# Altium project LED_Tree.PrjPcb
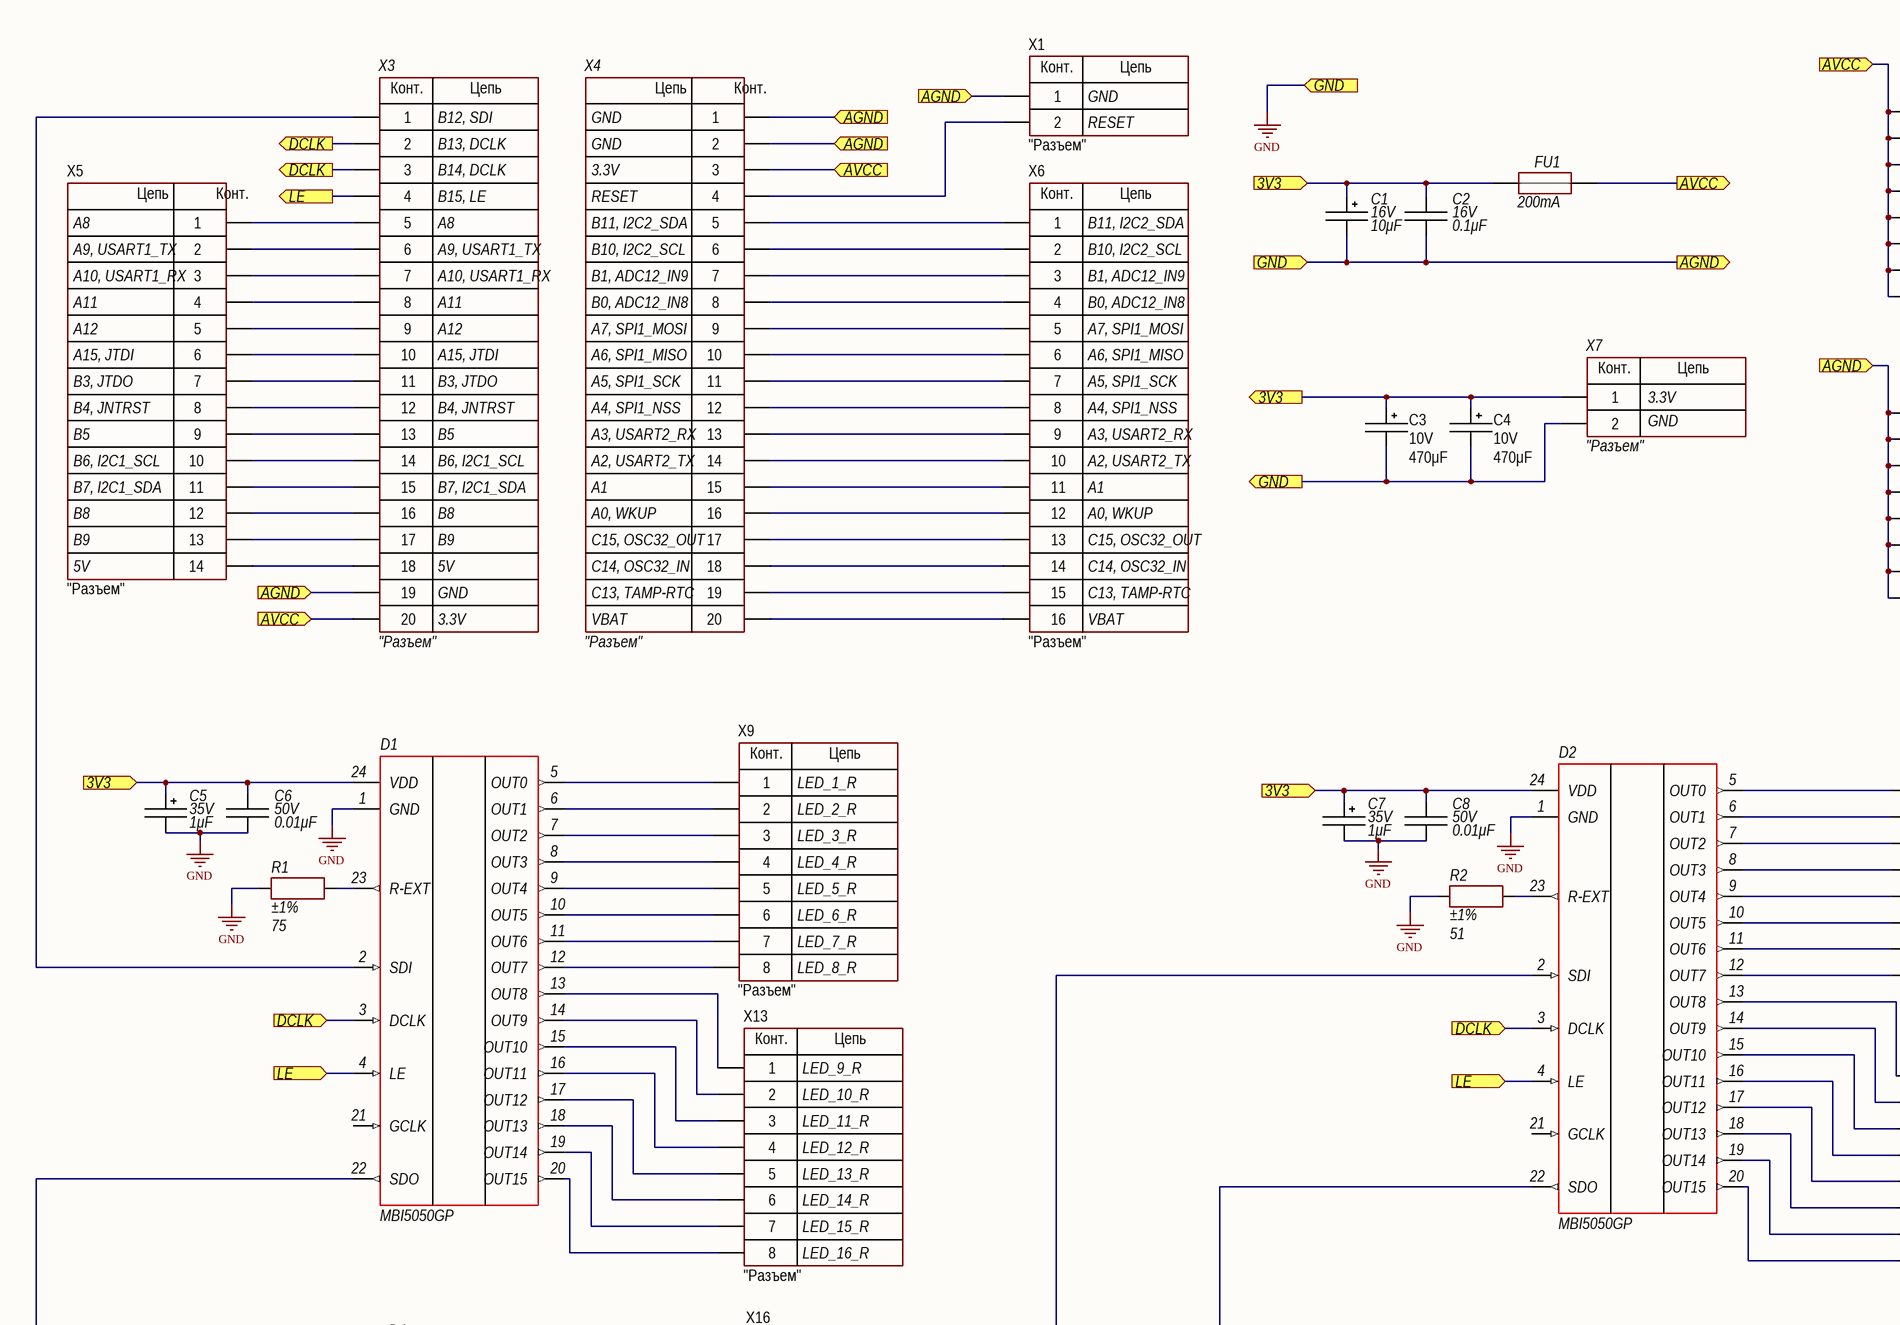
[diagram p0: Led_Tree_Main.SchDoc, top left]
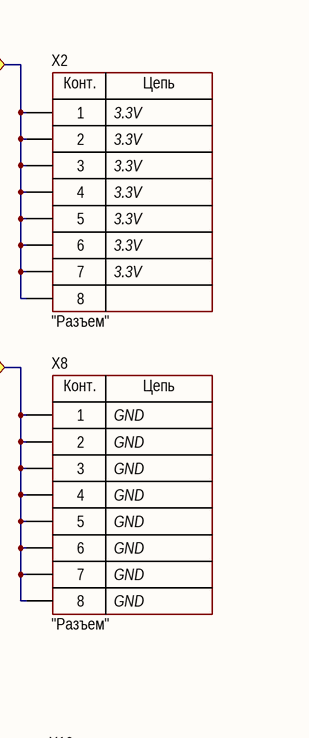
[diagram p1: Led_Tree_Main.SchDoc, top right]
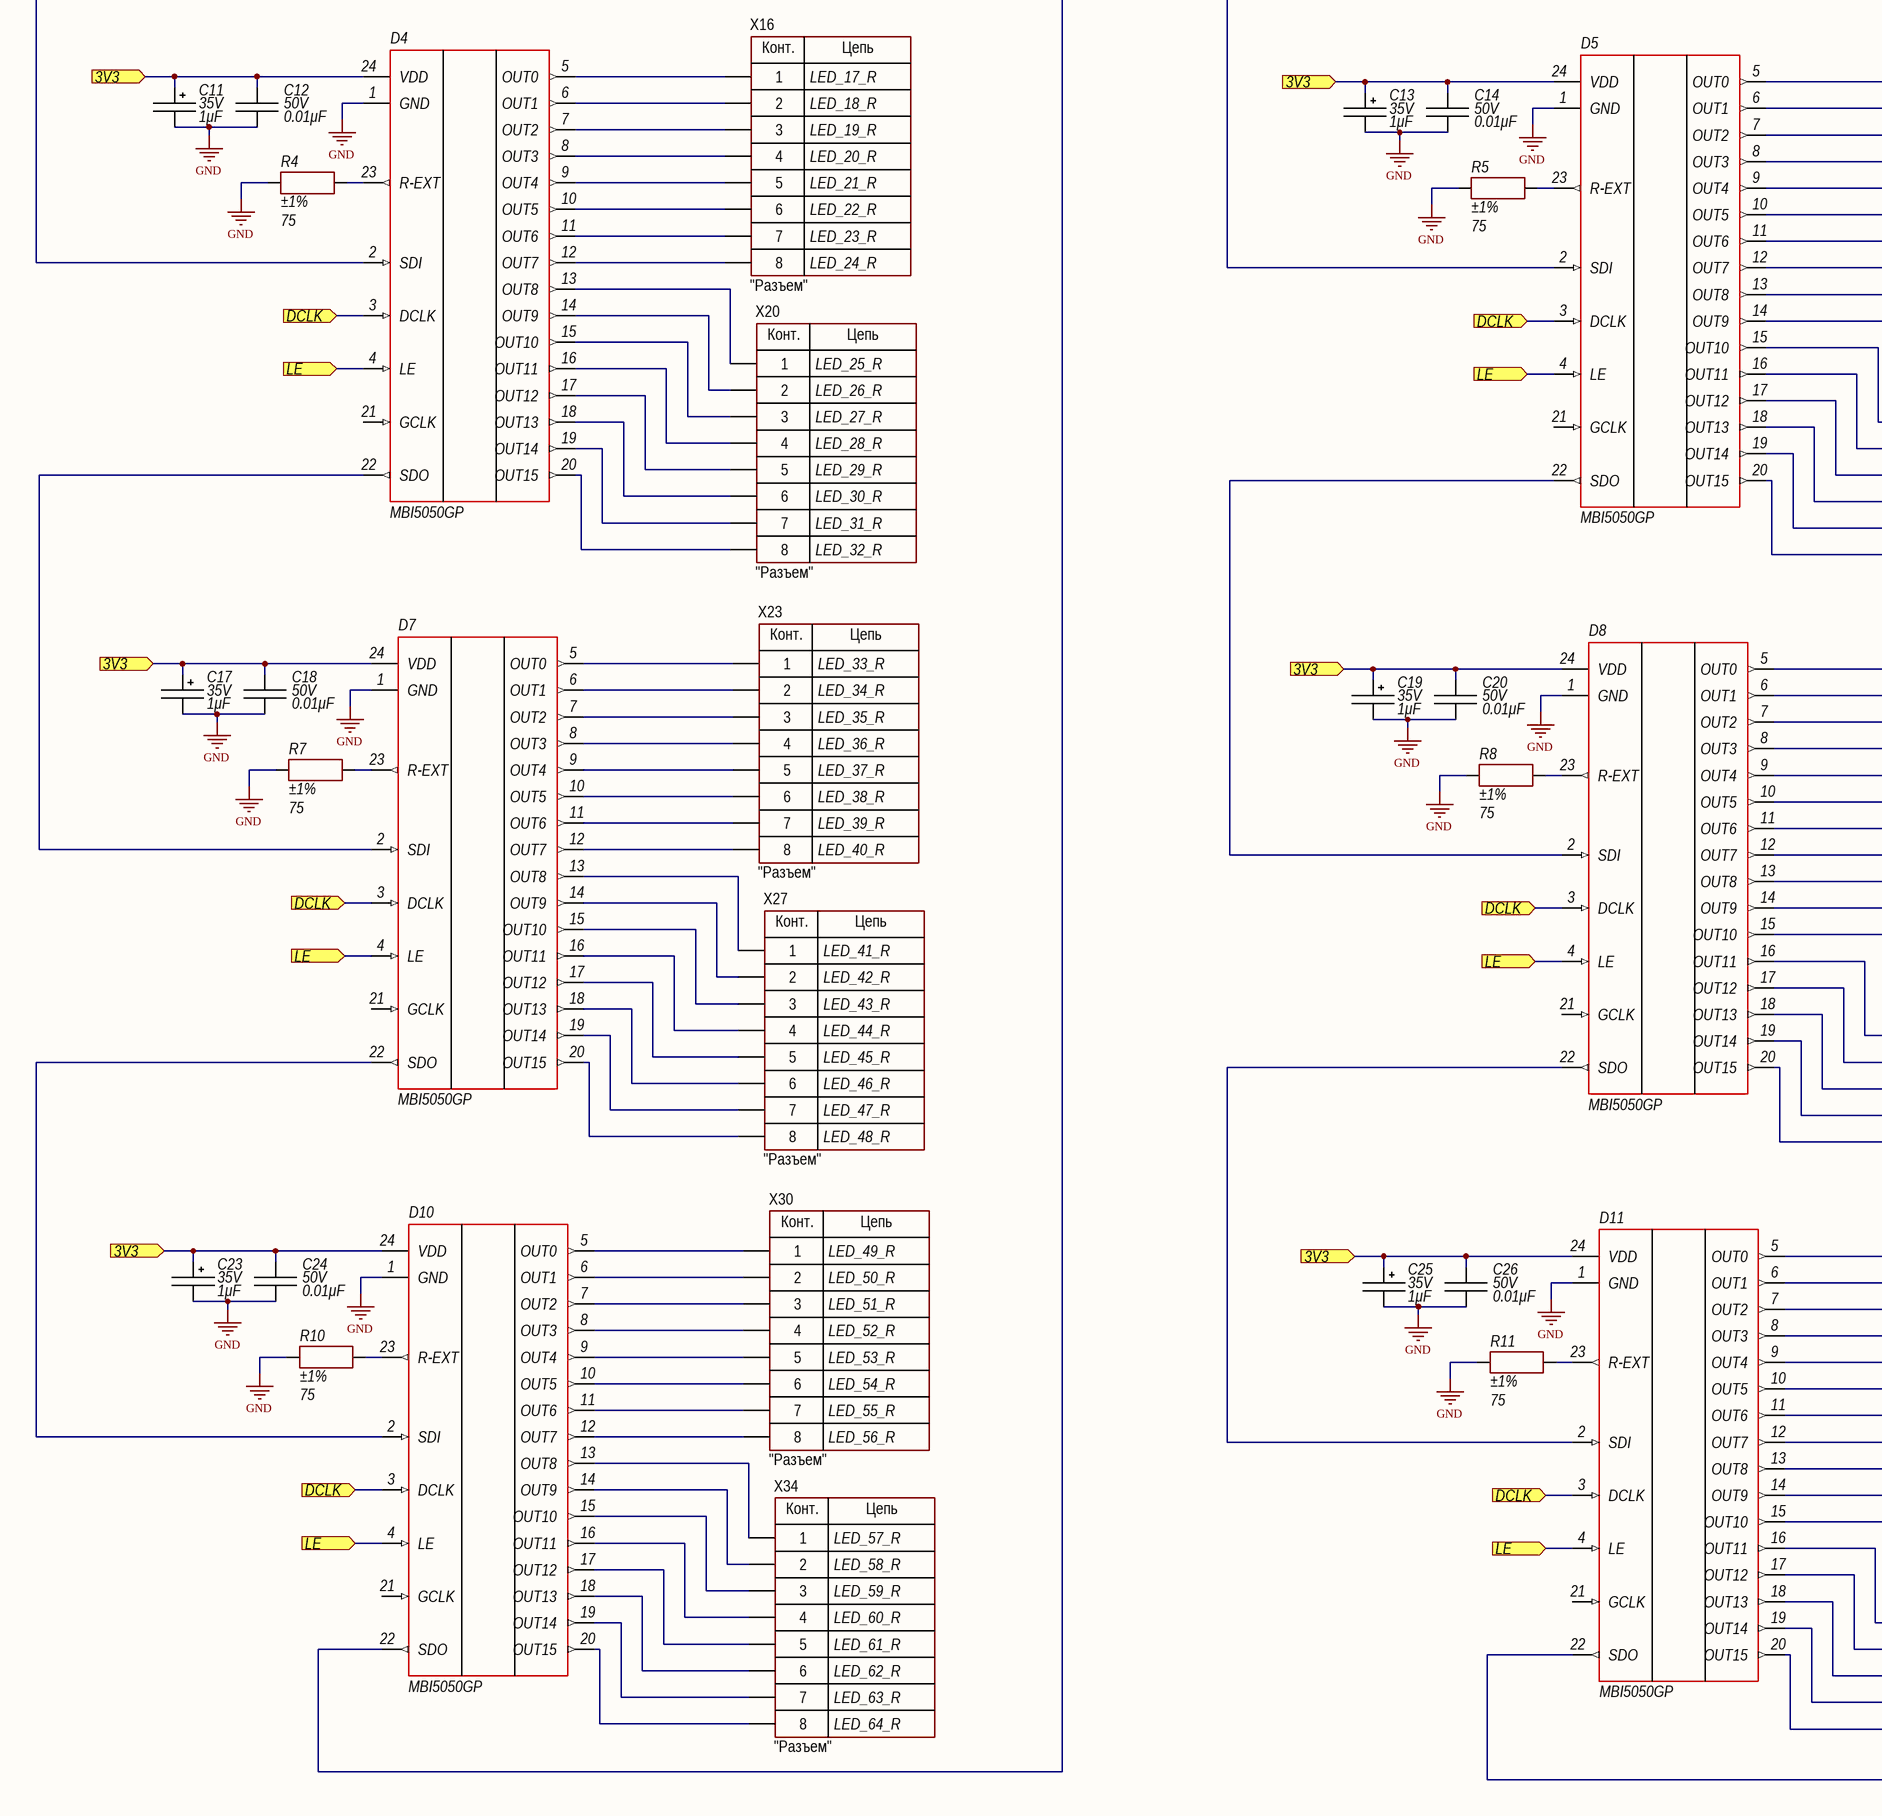
[diagram p2: Led_Tree_Main.SchDoc, bottom left]
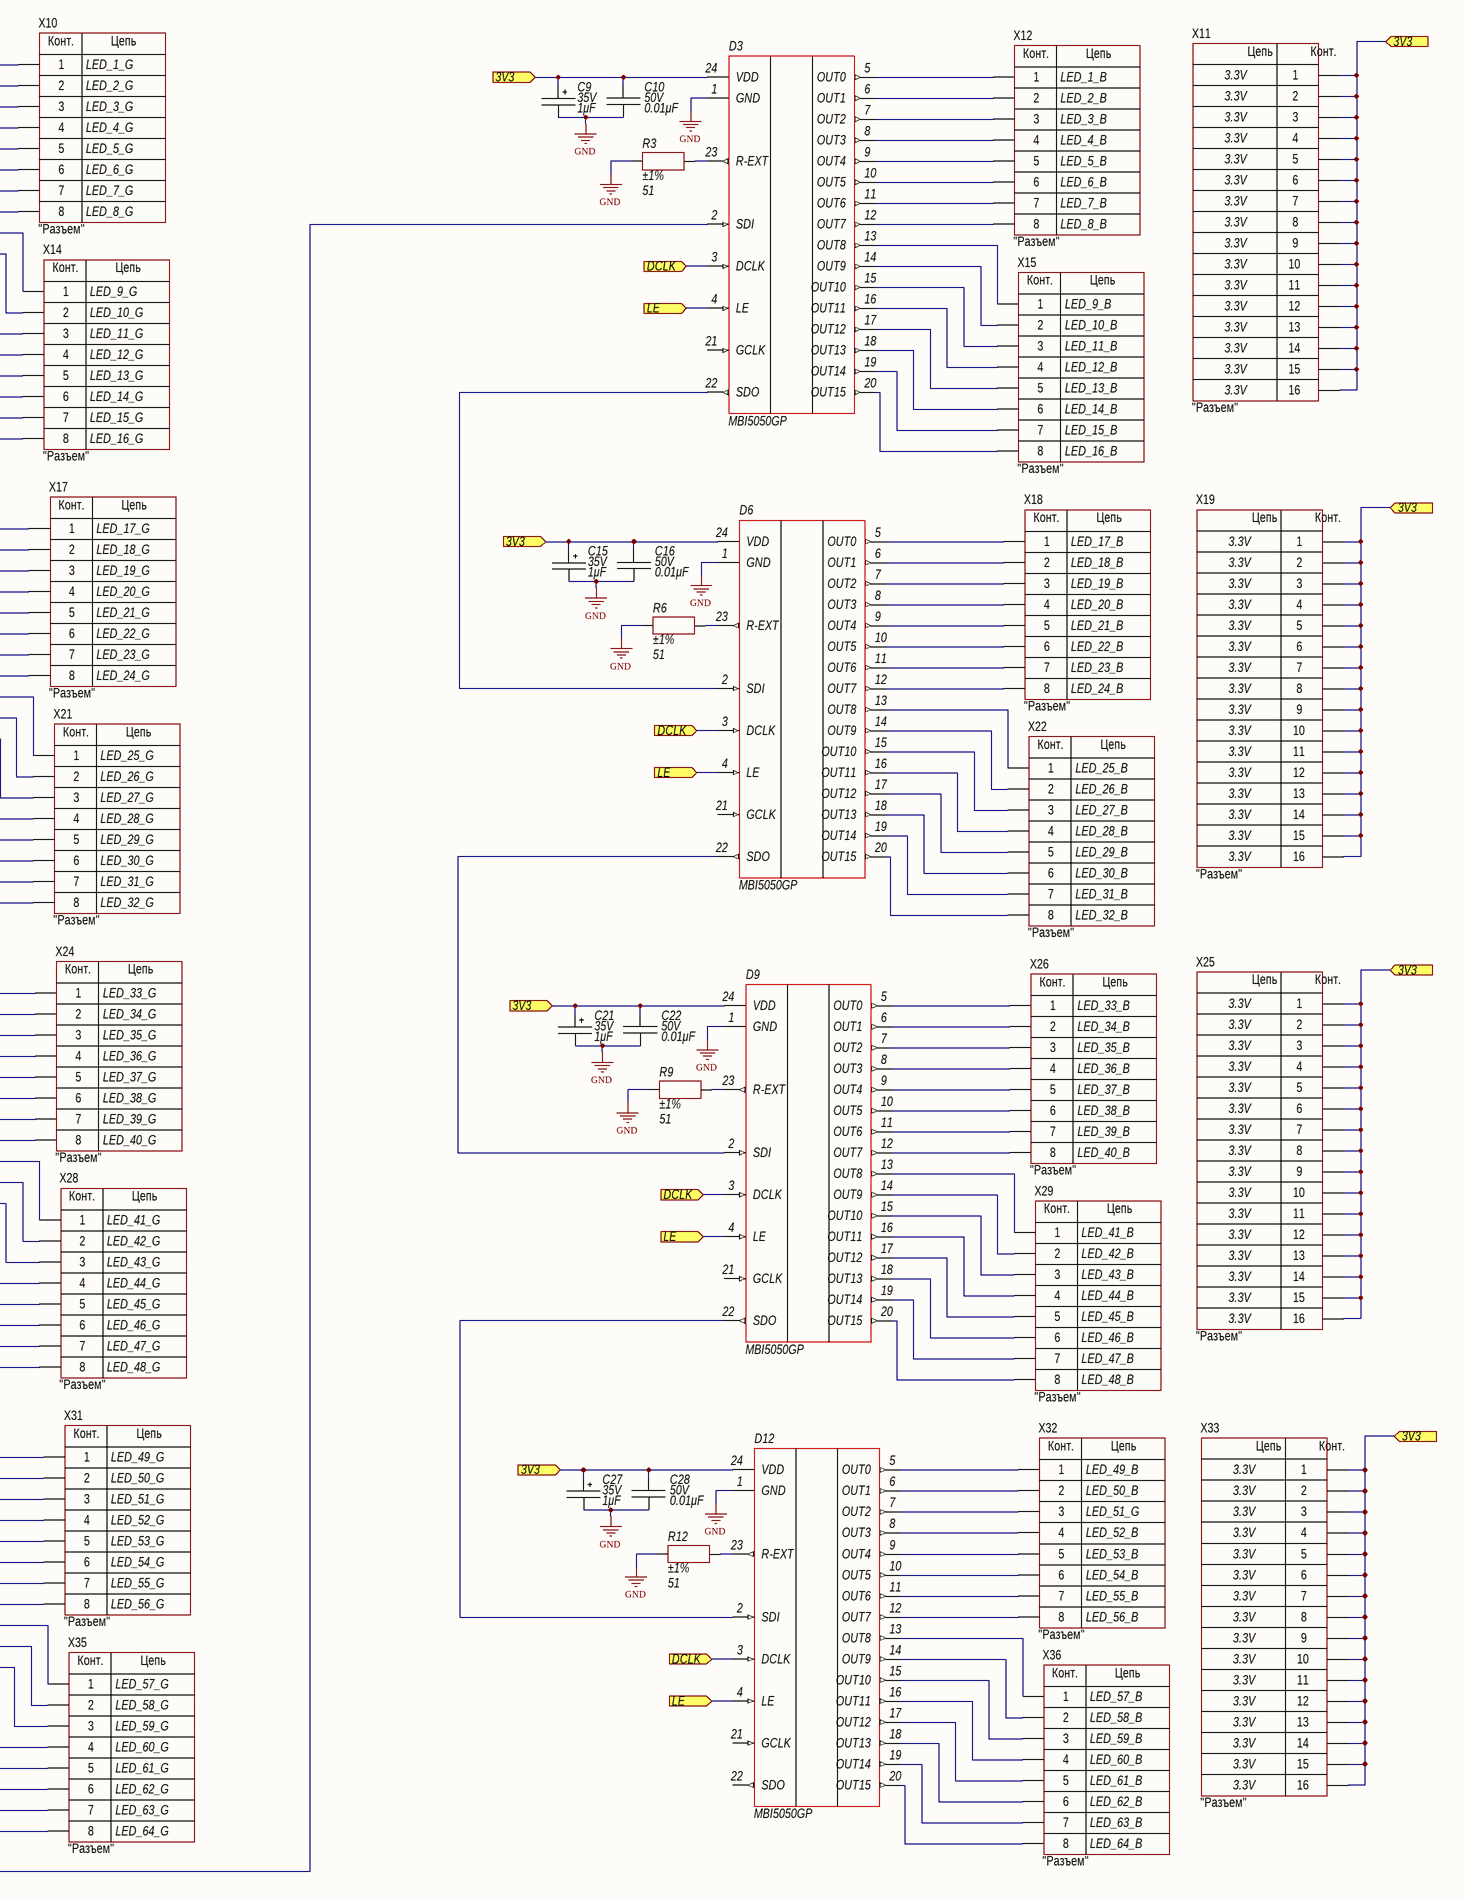
[diagram p3: Led_Tree_Main.SchDoc, bottom right]
1 sheet, 89 parts. Net scope: flat (ports and power ports of the same name join across sheets).
Board file: Led_Tree_Main .PcbDoc

## Sheet Led_Tree_Main.SchDoc
size 1188 x 840 mm; Date: 17.01.2021; Author: Чудаков М.А.; CompanyName: Maxon; DrawnBy: Чудаков М.А.; Address1: Address1; Address2: Address2; Address3: Address3; Address4: Address4; DocumentNumber: 000.000000.001 Э3; SheetNumber: 1; SheetTotal: 1; Scale: 1:1; Title2str: LED TREE; Letter1Column: И; DocumentType: Схема электрическая принципиальная; FirstReferrence: 0000.000000.001; CurrentDate: 17.01.2021; DocumentFullPathAndName: LED TREE; DocumentName: LED TREE; ModifiedDate: 17.01.2021; ProjectName: LED TREE

### Parts
C1  value 10μF  Voltage: 16V  [CAP: TANTAL-A]
C2  value 0.1μF  Voltage: 16V  [CAP: 0603]
C3  value 470μF  Voltage: 10V  [CAP: D6.3C2.5H11]
C4  value 470μF  Voltage: 10V  [CAP: D6.3C2.5H11]
C5  value 1μF  Voltage: 35V  [CAP: TANTAL-A]
C6  value 0.01μF  Voltage: 50V  [CAP: 0603]
C7  value 1μF  Voltage: 35V  [CAP: TANTAL-A]
C8  value 0.01μF  Voltage: 50V  [CAP: 0603]
C9  value 1μF  Voltage: 35V  [CAP: TANTAL-A]
C10  value 0.01μF  Voltage: 50V  [CAP: 0603]
C11  value 1μF  Voltage: 35V  [CAP: TANTAL-A]
C12  value 0.01μF  Voltage: 50V  [CAP: 0603]
C13  value 1μF  Voltage: 35V  [CAP: TANTAL-A]
C14  value 0.01μF  Voltage: 50V  [CAP: 0603]
C15  value 1μF  Voltage: 35V  [CAP: TANTAL-A]
C16  value 0.01μF  Voltage: 50V  [CAP: 0603]
C17  value 1μF  Voltage: 35V  [CAP: TANTAL-A]
C18  value 0.01μF  Voltage: 50V  [CAP: 0603]
C19  value 1μF  Voltage: 35V  [CAP: TANTAL-A]
C20  value 0.01μF  Voltage: 50V  [CAP: 0603]
C21  value 1μF  Voltage: 35V  [CAP: TANTAL-A]
C22  value 0.01μF  Voltage: 50V  [CAP: 0603]
C23  value 1μF  Voltage: 35V  [CAP: TANTAL-A]
C24  value 0.01μF  Voltage: 50V  [CAP: 0603]
C25  value 1μF  Voltage: 35V  [CAP: TANTAL-A]
C26  value 0.01μF  Voltage: 50V  [CAP: 0603]
C27  value 1μF  Voltage: 35V  [CAP: TANTAL-A]
C28  value 0.01μF  Voltage: 50V  [CAP: 0603]
D1  MBI5050GP  [MBI5050GP]
D2  MBI5050GP  [MBI5050GP]
D3  MBI5050GP  [MBI5050GP]
D4  MBI5050GP  [MBI5050GP]
D5  MBI5050GP  [MBI5050GP]
D6  MBI5050GP  [MBI5050GP]
D7  MBI5050GP  [MBI5050GP]
D8  MBI5050GP  [MBI5050GP]
D9  MBI5050GP  [MBI5050GP]
D10  MBI5050GP  [MBI5050GP]
D11  MBI5050GP  [MBI5050GP]
D12  MBI5050GP  [MBI5050GP]
FU1  200mA  [1210L020WR]
R1  value 75  Tolerance: ±1%  [RES: 0603]
R2  value 51  Tolerance: ±1%  [RES: 0603]
R3  value 51  Tolerance: ±1%  [RES: 0603]
R4  value 75  Tolerance: ±1%  [RES: 0603]
R5  value 75  Tolerance: ±1%  [RES: 0603]
R6  value 51  Tolerance: ±1%  [RES: 0603]
R7  value 75  Tolerance: ±1%  [RES: 0603]
R8  value 75  Tolerance: ±1%  [RES: 0603]
R9  value 51  Tolerance: ±1%  [RES: 0603]
R10  value 75  Tolerance: ±1%  [RES: 0603]
R11  value 75  Tolerance: ±1%  [RES: 0603]
R12  value 51  Tolerance: ±1%  [RES: 0603]
X1  CommentText: "Разъем"  [CON: PLS-2]
X2  CommentText: "Разъем"  [CON: PLS-8]
X3  CommentText: "Разъем"  [CON: PBS-20]
X4  CommentText: "Разъем"  [CON: PBS-20]
X5  CommentText: "Разъем"  [CON: PLS-14]
X6  CommentText: "Разъем"  [CON: PLS-16]
X7  CommentText: "Разъем"  [CON: TE 1-770166-0]
X8  CommentText: "Разъем"  [CON: PLS-8]
X9  CommentText: "Разъем"  [CON: PBS-8]
X10  CommentText: "Разъем"  [CON: PBS-8]
X11  CommentText: "Разъем"  [CON: PBS-16]
X12  CommentText: "Разъем"  [CON: PBS-8]
X13  CommentText: "Разъем"  [CON: PBS-8]
X14  CommentText: "Разъем"  [CON: PBS-8]
X15  CommentText: "Разъем"  [CON: PBS-8]
X16  CommentText: "Разъем"  [CON: PBS-8]
X17  CommentText: "Разъем"  [CON: PBS-8]
X18  CommentText: "Разъем"  [CON: PBS-8]
X19  CommentText: "Разъем"  [CON: PBS-16]
X20  CommentText: "Разъем"  [CON: PBS-8]
X21  CommentText: "Разъем"  [CON: PBS-8]
X22  CommentText: "Разъем"  [CON: PBS-8]
X23  CommentText: "Разъем"  [CON: PBS-8]
X24  CommentText: "Разъем"  [CON: PBS-8]
X25  CommentText: "Разъем"  [CON: PBS-16]
X26  CommentText: "Разъем"  [CON: PBS-8]
X27  CommentText: "Разъем"  [CON: PBS-8]
X28  CommentText: "Разъем"  [CON: PBS-8]
X29  CommentText: "Разъем"  [CON: PBS-8]
X30  CommentText: "Разъем"  [CON: PBS-8]
X31  CommentText: "Разъем"  [CON: PBS-8]
X32  CommentText: "Разъем"  [CON: PBS-8]
X33  CommentText: "Разъем"  [CON: PBS-16]
X34  CommentText: "Разъем"  [CON: PBS-8]
X35  CommentText: "Разъем"  [CON: PBS-8]
X36  CommentText: "Разъем"  [CON: PBS-8]

### Ports
3V3 (in), 3V3 (out), AGND (in), AGND (out), AVCC (in), AVCC (out), DCLK (in), DCLK (out), GND (in), GND (out), LE (in), LE (out)

### Nets
GND: C1.2 C2.1 C3.2 C4.2 C5.2 C6.1 C7.2 C8.1 C9.2 C10.1 C11.2 C12.1 C13.2 C14.1 C15.2 C16.1 C17.2 C18.1 C19.2 C20.1 C21.2 C22.1 C23.2 C24.1 C25.2 C26.1 C27.2 C28.1 D1.1(GND) D2.1(GND) D3.1(GND) D4.1(GND) D5.1(GND) D6.1(GND) D7.1(GND) D8.1(GND) D9.1(GND) D10.1(GND) D11.1(GND) D12.1(GND) R1.2 R2.2 R3.2 R4.2 R5.2 R6.2 R7.2 R8.2 R9.2 R10.2 R11.2 R12.2 X1.1 X3.19 X4.1 X4.2 X7.2 X8.1 X8.2 X8.3 X8.4 X8.5 X8.6 X8.7 X8.8 ; port AGND, port GND
NetC1_1: C1.1 C2.2 C3.1 C4.1 C5.1 C6.2 C7.1 C8.2 C9.1 C10.2 C11.1 C12.2 C13.1 C14.2 C15.1 C16.2 C17.1 C18.2 C19.1 C20.2 C21.1 C22.2 C23.1 C24.2 C25.1 C26.2 C27.1 C28.2 D1.24(VDD) D2.24(VDD) D3.24(VDD) D4.24(VDD) D5.24(VDD) D6.24(VDD) D7.24(VDD) D8.24(VDD) D9.24(VDD) D10.24(VDD) D11.24(VDD) D12.24(VDD) FU1.1 X7.1 X11.1 X11.2 X11.3 X11.4 X11.5 X11.6 X11.7 X11.8 X11.9 X11.10 X11.11 X11.12 X11.13 X11.14 X11.15 X11.16 X19.1 X19.2 X19.3 X19.4 X19.5 X19.6 X19.7 X19.8 X19.9 X19.10 X19.11 X19.12 X19.13 X19.14 X19.15 X19.16 X25.1 X25.2 X25.3 X25.4 X25.5 X25.6 X25.7 X25.8 X25.9 X25.10 X25.11 X25.12 X25.13 X25.14 X25.15 X25.16 X33.1 X33.2 X33.3 X33.4 X33.5 X33.6 X33.7 X33.8 X33.9 X33.10 X33.11 X33.12 X33.13 X33.14 X33.15 X33.16 ; port 3V3
NetD1_2: D1.2(SDI) X3.1
NetD1_3: D1.3(DCLK) D2.3(DCLK) D3.3(DCLK) D4.3(DCLK) D5.3(DCLK) D6.3(DCLK) D7.3(DCLK) D8.3(DCLK) D9.3(DCLK) D10.3(DCLK) D11.3(DCLK) D12.3(DCLK) X3.2 X3.3 ; port DCLK
NetD1_4: D1.4(LE) D2.4(LE) D3.4(LE) D4.4(LE) D5.4(LE) D6.4(LE) D7.4(LE) D8.4(LE) D9.4(LE) D10.4(LE) D11.4(LE) D12.4(LE) X3.4 ; port LE
NetD1_5: D1.5(OUT0) X9.1
NetD1_6: D1.6(OUT1) X9.2
NetD1_7: D1.7(OUT2) X9.3
NetD1_8: D1.8(OUT3) X9.4
NetD1_9: D1.9(OUT4) X9.5
NetD1_10: D1.10(OUT5) X9.6
NetD1_11: D1.11(OUT6) X9.7
NetD1_12: D1.12(OUT7) X9.8
NetD1_13: D1.13(OUT8) X13.1
NetD1_14: D1.14(OUT9) X13.2
NetD1_15: D1.15(OUT10) X13.3
NetD1_16: D1.16(OUT11) X13.4
NetD1_17: D1.17(OUT12) X13.5
NetD1_18: D1.18(OUT13) X13.6
NetD1_19: D1.19(OUT14) X13.7
NetD1_20: D1.20(OUT15) X13.8
NetD1_22: D1.22(SDO) D4.2(SDI)
NetD1_23: D1.23(R-EXT) R1.1
NetD2_2: D2.2(SDI) D10.22(SDO)
NetD2_5: D2.5(OUT0) X10.1
NetD2_6: D2.6(OUT1) X10.2
NetD2_7: D2.7(OUT2) X10.3
NetD2_8: D2.8(OUT3) X10.4
NetD2_9: D2.9(OUT4) X10.5
NetD2_10: D2.10(OUT5) X10.6
NetD2_11: D2.11(OUT6) X10.7
NetD2_12: D2.12(OUT7) X10.8
NetD2_13: D2.13(OUT8) X14.1
NetD2_14: D2.14(OUT9) X14.2
NetD2_15: D2.15(OUT10) X14.3
NetD2_16: D2.16(OUT11) X14.4
NetD2_17: D2.17(OUT12) X14.5
NetD2_18: D2.18(OUT13) X14.6
NetD2_19: D2.19(OUT14) X14.7
NetD2_20: D2.20(OUT15) X14.8
NetD2_22: D2.22(SDO) D5.2(SDI)
NetD2_23: D2.23(R-EXT) R2.1
NetD3_2: D3.2(SDI) D11.22(SDO)
NetD3_5: D3.5(OUT0) X12.1
NetD3_6: D3.6(OUT1) X12.2
NetD3_7: D3.7(OUT2) X12.3
NetD3_8: D3.8(OUT3) X12.4
NetD3_9: D3.9(OUT4) X12.5
NetD3_10: D3.10(OUT5) X12.6
NetD3_11: D3.11(OUT6) X12.7
NetD3_12: D3.12(OUT7) X12.8
NetD3_13: D3.13(OUT8) X15.1
NetD3_14: D3.14(OUT9) X15.2
NetD3_15: D3.15(OUT10) X15.3
NetD3_16: D3.16(OUT11) X15.4
NetD3_17: D3.17(OUT12) X15.5
NetD3_18: D3.18(OUT13) X15.6
NetD3_19: D3.19(OUT14) X15.7
NetD3_20: D3.20(OUT15) X15.8
NetD3_22: D3.22(SDO) D6.2(SDI)
NetD3_23: D3.23(R-EXT) R3.1
NetD4_5: D4.5(OUT0) X16.1
NetD4_6: D4.6(OUT1) X16.2
NetD4_7: D4.7(OUT2) X16.3
NetD4_8: D4.8(OUT3) X16.4
NetD4_9: D4.9(OUT4) X16.5
NetD4_10: D4.10(OUT5) X16.6
NetD4_11: D4.11(OUT6) X16.7
NetD4_12: D4.12(OUT7) X16.8
NetD4_13: D4.13(OUT8) X20.1
NetD4_14: D4.14(OUT9) X20.2
NetD4_15: D4.15(OUT10) X20.3
NetD4_16: D4.16(OUT11) X20.4
NetD4_17: D4.17(OUT12) X20.5
NetD4_18: D4.18(OUT13) X20.6
NetD4_19: D4.19(OUT14) X20.7
NetD4_20: D4.20(OUT15) X20.8
NetD4_22: D4.22(SDO) D7.2(SDI)
NetD4_23: D4.23(R-EXT) R4.1
NetD5_5: D5.5(OUT0) X17.1
NetD5_6: D5.6(OUT1) X17.2
NetD5_7: D5.7(OUT2) X17.3
NetD5_8: D5.8(OUT3) X17.4
NetD5_9: D5.9(OUT4) X17.5
NetD5_10: D5.10(OUT5) X17.6
NetD5_11: D5.11(OUT6) X17.7
NetD5_12: D5.12(OUT7) X17.8
NetD5_13: D5.13(OUT8) X21.1
NetD5_14: D5.14(OUT9) X21.2
NetD5_15: D5.15(OUT10) X21.3
NetD5_16: D5.16(OUT11) X21.4
NetD5_17: D5.17(OUT12) X21.5
NetD5_18: D5.18(OUT13) X21.6
NetD5_19: D5.19(OUT14) X21.7
NetD5_20: D5.20(OUT15) X21.8
NetD5_22: D5.22(SDO) D8.2(SDI)
NetD5_23: D5.23(R-EXT) R5.1
NetD6_5: D6.5(OUT0) X18.1
NetD6_6: D6.6(OUT1) X18.2
NetD6_7: D6.7(OUT2) X18.3
NetD6_8: D6.8(OUT3) X18.4
NetD6_9: D6.9(OUT4) X18.5
NetD6_10: D6.10(OUT5) X18.6
NetD6_11: D6.11(OUT6) X18.7
NetD6_12: D6.12(OUT7) X18.8
NetD6_13: D6.13(OUT8) X22.1
NetD6_14: D6.14(OUT9) X22.2
NetD6_15: D6.15(OUT10) X22.3
NetD6_16: D6.16(OUT11) X22.4
NetD6_17: D6.17(OUT12) X22.5
NetD6_18: D6.18(OUT13) X22.6
NetD6_19: D6.19(OUT14) X22.7
NetD6_20: D6.20(OUT15) X22.8
NetD6_22: D6.22(SDO) D9.2(SDI)
NetD6_23: D6.23(R-EXT) R6.1
NetD7_5: D7.5(OUT0) X23.1
NetD7_6: D7.6(OUT1) X23.2
NetD7_7: D7.7(OUT2) X23.3
NetD7_8: D7.8(OUT3) X23.4
NetD7_9: D7.9(OUT4) X23.5
NetD7_10: D7.10(OUT5) X23.6
NetD7_11: D7.11(OUT6) X23.7
NetD7_12: D7.12(OUT7) X23.8
NetD7_13: D7.13(OUT8) X27.1
NetD7_14: D7.14(OUT9) X27.2
NetD7_15: D7.15(OUT10) X27.3
NetD7_16: D7.16(OUT11) X27.4
NetD7_17: D7.17(OUT12) X27.5
NetD7_18: D7.18(OUT13) X27.6
NetD7_19: D7.19(OUT14) X27.7
NetD7_20: D7.20(OUT15) X27.8
NetD7_22: D7.22(SDO) D10.2(SDI)
NetD7_23: D7.23(R-EXT) R7.1
NetD8_5: D8.5(OUT0) X24.1
NetD8_6: D8.6(OUT1) X24.2
NetD8_7: D8.7(OUT2) X24.3
NetD8_8: D8.8(OUT3) X24.4
NetD8_9: D8.9(OUT4) X24.5
NetD8_10: D8.10(OUT5) X24.6
NetD8_11: D8.11(OUT6) X24.7
NetD8_12: D8.12(OUT7) X24.8
NetD8_13: D8.13(OUT8) X28.1
NetD8_14: D8.14(OUT9) X28.2
NetD8_15: D8.15(OUT10) X28.3
NetD8_16: D8.16(OUT11) X28.4
NetD8_17: D8.17(OUT12) X28.5
NetD8_18: D8.18(OUT13) X28.6
NetD8_19: D8.19(OUT14) X28.7
NetD8_20: D8.20(OUT15) X28.8
NetD8_22: D8.22(SDO) D11.2(SDI)
NetD8_23: D8.23(R-EXT) R8.1
NetD9_5: D9.5(OUT0) X26.1
NetD9_6: D9.6(OUT1) X26.2
NetD9_7: D9.7(OUT2) X26.3
NetD9_8: D9.8(OUT3) X26.4
NetD9_9: D9.9(OUT4) X26.5
NetD9_10: D9.10(OUT5) X26.6
NetD9_11: D9.11(OUT6) X26.7
NetD9_12: D9.12(OUT7) X26.8
NetD9_13: D9.13(OUT8) X29.1
NetD9_14: D9.14(OUT9) X29.2
NetD9_15: D9.15(OUT10) X29.3
NetD9_16: D9.16(OUT11) X29.4
NetD9_17: D9.17(OUT12) X29.5
NetD9_18: D9.18(OUT13) X29.6
NetD9_19: D9.19(OUT14) X29.7
NetD9_20: D9.20(OUT15) X29.8
NetD9_22: D9.22(SDO) D12.2(SDI)
NetD9_23: D9.23(R-EXT) R9.1
NetD10_5: D10.5(OUT0) X30.1
NetD10_6: D10.6(OUT1) X30.2
NetD10_7: D10.7(OUT2) X30.3
NetD10_8: D10.8(OUT3) X30.4
NetD10_9: D10.9(OUT4) X30.5
NetD10_10: D10.10(OUT5) X30.6
NetD10_11: D10.11(OUT6) X30.7
NetD10_12: D10.12(OUT7) X30.8
NetD10_13: D10.13(OUT8) X34.1
NetD10_14: D10.14(OUT9) X34.2
NetD10_15: D10.15(OUT10) X34.3
NetD10_16: D10.16(OUT11) X34.4
NetD10_17: D10.17(OUT12) X34.5
NetD10_18: D10.18(OUT13) X34.6
NetD10_19: D10.19(OUT14) X34.7
NetD10_20: D10.20(OUT15) X34.8
NetD10_23: D10.23(R-EXT) R10.1
NetD11_5: D11.5(OUT0) X31.1
NetD11_6: D11.6(OUT1) X31.2
NetD11_7: D11.7(OUT2) X31.3
NetD11_8: D11.8(OUT3) X31.4
NetD11_9: D11.9(OUT4) X31.5
NetD11_10: D11.10(OUT5) X31.6
NetD11_11: D11.11(OUT6) X31.7
NetD11_12: D11.12(OUT7) X31.8
NetD11_13: D11.13(OUT8) X35.1
NetD11_14: D11.14(OUT9) X35.2
NetD11_15: D11.15(OUT10) X35.3
NetD11_16: D11.16(OUT11) X35.4
NetD11_17: D11.17(OUT12) X35.5
NetD11_18: D11.18(OUT13) X35.6
NetD11_19: D11.19(OUT14) X35.7
NetD11_20: D11.20(OUT15) X35.8
NetD11_23: D11.23(R-EXT) R11.1
NetD12_5: D12.5(OUT0) X32.1
NetD12_6: D12.6(OUT1) X32.2
NetD12_7: D12.7(OUT2) X32.3
NetD12_8: D12.8(OUT3) X32.4
NetD12_9: D12.9(OUT4) X32.5
NetD12_10: D12.10(OUT5) X32.6
NetD12_11: D12.11(OUT6) X32.7
NetD12_12: D12.12(OUT7) X32.8
NetD12_13: D12.13(OUT8) X36.1
NetD12_14: D12.14(OUT9) X36.2
NetD12_15: D12.15(OUT10) X36.3
NetD12_16: D12.16(OUT11) X36.4
NetD12_17: D12.17(OUT12) X36.5
NetD12_18: D12.18(OUT13) X36.6
NetD12_19: D12.19(OUT14) X36.7
NetD12_20: D12.20(OUT15) X36.8
NetD12_23: D12.23(R-EXT) R12.1
NetFU1_2: FU1.2 X2.1 X2.2 X2.3 X2.4 X2.5 X2.6 X2.7 X2.8 X3.20 X4.3 ; port AVCC
NetX1_2: X1.2 X4.4
NetX3_5: X3.5 X5.1
NetX3_6: X3.6 X5.2
NetX3_7: X3.7 X5.3
NetX3_8: X3.8 X5.4
NetX3_9: X3.9 X5.5
NetX3_10: X3.10 X5.6
NetX3_11: X3.11 X5.7
NetX3_12: X3.12 X5.8
NetX3_13: X3.13 X5.9
NetX3_14: X3.14 X5.10
NetX3_15: X3.15 X5.11
NetX3_16: X3.16 X5.12
NetX3_17: X3.17 X5.13
NetX3_18: X3.18 X5.14
NetX4_5: X4.5 X6.1
NetX4_6: X4.6 X6.2
NetX4_7: X4.7 X6.3
NetX4_8: X4.8 X6.4
NetX4_9: X4.9 X6.5
NetX4_10: X4.10 X6.6
NetX4_11: X4.11 X6.7
NetX4_12: X4.12 X6.8
NetX4_13: X4.13 X6.9
NetX4_14: X4.14 X6.10
NetX4_15: X4.15 X6.11
NetX4_16: X4.16 X6.12
NetX4_17: X4.17 X6.13
NetX4_18: X4.18 X6.14
NetX4_19: X4.19 X6.15
NetX4_20: X4.20 X6.16

Not connected (* = marked no-connect by the designer): D1 21(GCLK); D2 21(GCLK); D3 21(GCLK); D4 21(GCLK); D5 21(GCLK); D6 21(GCLK); D7 21(GCLK); D8 21(GCLK); D9 21(GCLK); D10 21(GCLK); D11 21(GCLK); D12 21(GCLK) 22(SDO)

### Notes on the sheet
- B12, SDI
- GND
- RESET
- 3.3V
- B13, DCLK
- B14, DCLK
- A8
- (near X5) A9, USART1_TX
- B15, LE
- A9, USART1_TX
- (near X4) B11, I2C2_SDA
- (near X4) B10, I2C2_SCL
- B11, I2C2_SDA
- B10, I2C2_SCL
- (near X5) A10, USART1_RX
- A11
- A12
- A10, USART1_RX
- (near X4) B1, ADC12_IN9
- (near X4) B0, ADC12_IN8
- (near X4) A7, SPI1_MOSI
- B1, ADC12_IN9
- B0, ADC12_IN8
- A7, SPI1_MOSI
- A15, JTDI
- B3, JTDO
- (near X4) A6, SPI1_MISO
- (near X4) A5, SPI1_SCK
- A6, SPI1_MISO
- A5, SPI1_SCK
- B4, JNTRST
- B5
- (near X5) B6, I2C1_SCL
- B6, I2C1_SCL
- (near X4) A4, SPI1_NSS
- (near X4) A3, USART2_RX
- (near X4) A2, USART2_TX
- A4, SPI1_NSS
- A3, USART2_RX
- A2, USART2_TX
- (near X5) B7, I2C1_SDA
- B8
- B7, I2C1_SDA
- A1
- A0, WKUP
- B9
- 5V
- (near X4) C15, OSC32_OUT
- (near X4) C14, OSC32_IN
- (near X4) C13, TAMP-RTC
- C15, OSC32_OUT
- C14, OSC32_IN
- C13, TAMP-RTC
- VBAT
- LED_1_R
- LED_1_G
- LED_2_R
- LED_3_R
- LED_4_R
- LED_2_G
- LED_3_G
- LED_1_B
- LED_2_B
- LED_3_B
- LED_5_R
- LED_6_R
- LED_4_G
- LED_5_G
- LED_6_G
- LED_4_B
- LED_5_B
- LED_7_R
- LED_8_R
- LED_7_G
- LED_8_G
- LED_6_B
- LED_7_B
- LED_8_B
- LED_9_R
- LED_10_R
- LED_11_R
- LED_9_G
- LED_10_G
- LED_11_G
- LED_9_B
- LED_10_B
- LED_12_R
- LED_13_R
- LED_14_R
- LED_12_G
- LED_13_G
- LED_11_B
- LED_12_B
- LED_13_B
- LED_15_R
- LED_16_R
- LED_14_G
- LED_15_G
- LED_16_G
- LED_14_B
- LED_15_B
- LED_16_B
- LED_17_R
- LED_18_R
- LED_17_G
- LED_18_G
- LED_17_B
- LED_19_R
- LED_20_R
- LED_19_G
- LED_20_G
- LED_18_B
- LED_19_B
- LED_20_B
- LED_21_R
- LED_22_R
- LED_23_R
- LED_21_G
- LED_22_G
- LED_23_G
- LED_21_B
- LED_22_B
- LED_24_R
- LED_24_G
- LED_23_B
- LED_24_B
- LED_25_R
- LED_25_G
- LED_26_R
- LED_27_R
- LED_28_R
- LED_26_G
- LED_27_G
- LED_25_B
- LED_26_B
- LED_27_B
- LED_29_R
- LED_30_R
- LED_28_G
- LED_29_G
- LED_30_G
- LED_28_B
- LED_29_B
- LED_31_R
- LED_32_R
- LED_31_G
- LED_32_G
- LED_30_B
- LED_31_B
- LED_32_B
- LED_33_R
- LED_34_R
- LED_35_R
- LED_33_G
- LED_34_G
- LED_33_B
- LED_34_B
- LED_36_R
- LED_37_R
- LED_35_G
- LED_36_G
- LED_37_G
- LED_35_B
- LED_36_B
- LED_38_R
- LED_39_R
- LED_40_R
- LED_38_G
- LED_39_G
- LED_37_B
- LED_38_B
- LED_39_B
- LED_40_G
- LED_40_B
- LED_41_R
- LED_42_R
- LED_41_G
- LED_42_G
- LED_41_B
- LED_43_R
- LED_44_R
- LED_43_G
- LED_44_G
- LED_42_B
- LED_43_B
- LED_44_B
- LED_45_R
- LED_46_R
- LED_47_R
- LED_45_G
- LED_46_G
- LED_47_G
- LED_45_B
- LED_46_B
- LED_48_R
- LED_48_G
- LED_47_B
- LED_48_B
- LED_49_R
- LED_49_G
- LED_50_R
- LED_51_R
- LED_50_G
- LED_51_G
- LED_49_B
- LED_50_B
- LED_52_R
- LED_53_R
- LED_54_R
- LED_52_G
- LED_53_G
- LED_54_G
- LED_52_B
- LED_53_B
- LED_55_R
- LED_56_R
- LED_55_G
- LED_56_G
- LED_54_B
- LED_55_B
- LED_56_B
- LED_57_R
- LED_58_R
- LED_59_R
- LED_57_G
- LED_58_G
- LED_57_B
- LED_58_B
- LED_60_R
- LED_61_R
- LED_59_G
- LED_60_G
- LED_61_G
- LED_59_B
- LED_60_B
- LED_62_R
- LED_63_R
- LED_64_R
- LED_62_G
- LED_63_G
- LED_64_G
- LED_61_B
- LED_62_B
- LED_63_B
- LED_64_B
- Перв. примен.
- Справ. №
- Подп. и дата
- Инв. № дубл.
- Взам. инв. №
- Разраб.
- Изм.
- Лист
- № докум.
- Подп.
- Дата
- Лит.
- Масса
- Масштаб
- Пров.
- Т.контр.
- Листов
- Инв. № подл.
- Утв.
- Н.контр.
- 2.106-A1
- Копировал
- Формат А0
- (in symbol PBS-8) Конт.; Цепь
- (in symbol PBS-16) Цепь; Конт.
- (in symbol PBS-20) Цепь; Конт.
- (in symbol PLS-2) Конт.; Цепь
- (in symbol PLS-8) Конт.; Цепь
- (in symbol PLS-14) Цепь; Конт.
- (in symbol PLS-16) Конт.; Цепь
- (in symbol TE 1-770166-0) Конт.; Цепь

### Library data of the parts
C1 = Tantal_A: Manufacturer: AVX; PartNumber: TAJA106K016RNJ; ValueManufacturerPartNumber: Tantalum capacitor, 10μF, 16V, ±10%, 3Ohm, case A (3216), -55...+125°C; Impedance: 3Ohm; Tolerance: ±10%; TypeCapacitor: Tantalum capacitor; Package: case A (3216); HelpURL: https://www.digikey.com/product-detail/en/avx-corporation/TAJA106K016RNJ/478-1655-1-ND/564687; Temperature: -55...+125°C
C2 = Ceramic_0603: Manufacturer: Murata Electronics; PartNumber: GRM188R71C104KA01D; ValueManufacturerPartNumber: Ceramic capacitor, 0.1μF, X7R, ±10%, 16V, 0603, -55...+125°C; TypeCapacitor: Ceramic capacitor; Tolerance: ±10%; TypeDielectric: X7R; Package: 0603; HelpURL: https://www.digikey.com/product-detail/en/murata-electronics/GRM188R71C104KA01D/490-1532-2-ND/587060; Temperature: -55...+125°C
C3 C4 = Aluminium: Manufacturer: JB; PartNumber: JRB1A471M02500630120000B; ValueManufacturerPartNumber: Aluminium capacitor, 470μF, 10V, ±20%, , 14x10x5 mm, -40...+105°C; TypeCapacitor: Aluminium capacitor; Tolerance: ±20%; Package: 14x10x5 mm; HelpURL: https://www.digikey.com/product-detail/en/wurth-electronics-inc/860080475013/732-9029-1-ND/5728972; Temperature: -40...+105°C
C5 C7 C9 C11 C13 C15 C17 C19 C21 C23 C25 C27 = Tantal_A: Manufacturer: AVX; PartNumber: TAJA105K035RNJ; ValueManufacturerPartNumber: Tantalum capacitor, 1μF, 35V, ±10%, 7.5Ohm, case A (3216), -55...+125°C; Impedance: 7.5Ohm; Tolerance: ±10%; TypeCapacitor: Tantalum capacitor; Package: case A (3216); HelpURL: https://www.digikey.com/product-detail/en/avx-corporation/TAJA105K035RNJ/478-1651-2-ND/563759; Temperature: -55...+125°C
C6 C8 C10 C12 C14 C16 C18 C20 C22 C24 C26 C28 = Ceramic_0603: Manufacturer: Murata Electronics; PartNumber: GRM188R71H103KA01D; ValueManufacturerPartNumber: Ceramic capacitor, 0.01μF, X7R, ±10%, 50V, 0603, -55...+125°C; TypeCapacitor: Ceramic capacitor; Tolerance: ±10%; TypeDielectric: X7R; Package: 0603; HelpURL: https://www.digikey.com/product-detail/en/murata-electronics/GRM188R71H103KA01D/490-1512-2-ND/587151; Temperature: -55...+125°C
D1-D12 = MBI5050GP: 16ch PWM LED Driver; Manufacture: Macroblock; HelpURL: https://www.electronshik.ru/item/MBI/MBI5050GP; Case: SSOP24L-150-0.64; Model: MBI5050GP
FU1 = 1210L020WR: Manufacture: Littlefuse; Model: 1210L020WR; HelpURL: https://www.electronshik.ru/item/LTL/1210L020WR; Case: 1210; Value: 200mA
R1 R4 R5 R7 R8 R10 R11 = Resistor_0603: Manufacturer: Yageo; PartNumber: RC0603FR-0775RL; ValueManufacturerPartNumber: Resistor film, 75, ±1%, 0603, 0.1W, -55...+155°C; TypeResistor: Resistor film; Power: 0.1W; Package: 0603; HelpURL: https://www.digikey.com/en/products/detail/yageo/RC0603FR-0775RL/727377?s=N4IgTCBcDaIEoGEAMA2JBmAYnAtEg7PgKxwAyIAugL5A; Temperature: -55...+155°C
R2 R3 R6 R9 R12 = Resistor_0603: Manufacturer: Yageo; PartNumber: RC0603FR-0751RL; ValueManufacturerPartNumber: Resistor film, 51, ±1%, 0603, 0.1W, -55...+155°C; TypeResistor: Resistor film; Power: 0.1W; Package: 0603; Temperature: -55...+155°C
  R2 R3: HelpURL: https://www.digikey.com/en/products/detail/yageo/RC0603FR-0751RL/727281?s=N4IgTCBcDaIEoGEAMA2JBmAYnAtEg7AKwCMcAMiALoC%2BQA
  R6 R9 R12: HelpURL: https://www.digikey.com/en/products/detail/yageo/RC0603FR-0775RL/727377?s=N4IgTCBcDaIEoGEAMA2JBmAYnAtEg7PgKxwAyIAugL5A
X1 = PLS-2: Manufacturer: Connfly; ValueManufacturerPartNumber: Connector, 2pin, 2.54mm, 500VAC, 3A; TypeConnector: Connector; VoltageMax: 500VAC; Pitch: 2.54mm; CurrentMax: 3A; Multichannel: 2pin; HelpURL: https://www.chipdip.ru/product/pls-2; PartNumber: PLS-2
X2 X8 = PLS-8: Manufacturer: Connfly; ValueManufacturerPartNumber: Connector, 8pin, 2.54mm, 500VAC, 3A; TypeConnector: Connector; VoltageMax: 500VAC; Pitch: 2.54mm; CurrentMax: 3A; Multichannel: 8pin; HelpURL: https://www.chipdip.ru/product/pls-8-ds1021-1-8sf112; PartNumber: PLS-8
X3 X4 = PBS-20: Manufacturer: Connfly; ValueManufacturerPartNumber: Connector, 20pin, 2.54mm, 500VAC, 3A; CurrentMax: 3A; Multichannel: 20pin; Pitch: 2.54mm; TypeConnector: Connector; VoltageMax: 500VAC; HelpURL: https://www.chipdip.ru/product/pbs20; PartNumber: PBS-20
X5 = PLS-14: Manufacturer: Connfly; ValueManufacturerPartNumber: Connector, 14pin, 2.54mm, 500VAC, 3A; TypeConnector: Connector; VoltageMax: 500VAC; Pitch: 2.54mm; CurrentMax: 3A; Multichannel: 14pin; HelpURL: https://www.chipdip.ru/product/pls-14; PartNumber: PLS-14
X6 = PLS-16: Manufacturer: Connfly; ValueManufacturerPartNumber: Connector, 16pin, 2.54mm, 500VAC, 3A; TypeConnector: Connector; VoltageMax: 500VAC; Pitch: 2.54mm; CurrentMax: 3A; Multichannel: 16pin; HelpURL: https://www.chipdip.ru/product/pls-16; PartNumber: PLS-16
X7 = TE 1-770166-0: Power plug, to board, 2 pins; Manufacturer: TE Connectivity; ValueManufacturerPartNumber: Connector, 2pin, 4.14mm, 600VAC, 9.5A; CurrentMax: 9.5A; Multichannel: 2pin; Pitch: 4.14mm; TypeConnector: Connector; VoltageMax: 600VAC; HelpURL: https://www.chipdip.ru/product1/8001994596?from=suggest_product; PartNumber: 1-770166-0
X9 X10 X12-X18 X20-X24 X26-X32 X34-X36 = PBS-8: Manufacturer: Connfly; ValueManufacturerPartNumber: Connector, 8pin, 2.54mm, 500VAC, 3A; TypeConnector: Connector; VoltageMax: 500VAC; Pitch: 2.54mm; CurrentMax: 3A; Multichannel: 8pin; HelpURL: https://www.chipdip.ru/product/pbs-8; PartNumber: PBS-8
X11 X19 X25 X33 = PBS-16: Manufacturer: Connfly; ValueManufacturerPartNumber: Connector, 16pin, 2.54mm, 500VAC, 3A; TypeConnector: Connector; VoltageMax: 500VAC; Pitch: 2.54mm; CurrentMax: 3A; Multichannel: 16pin; HelpURL: https://www.chipdip.ru/product/pbs16; PartNumber: PBS-16